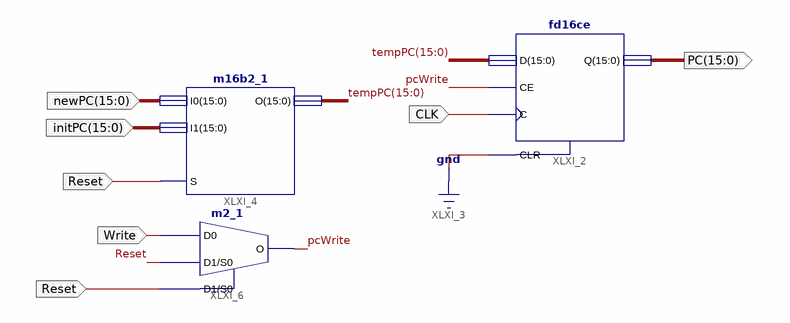
[diagram p0: schematic sheet 1]
// Xilinx ISE schematic pcReg16.sch (spartan3e) as structural Verilog: 3 symbols, 6 ports
module pcReg16 (
  input  CLK,
  input  Reset,
  input  [15:0] initPC,
  input  [15:0] newPC,
  input  Write,
  output [15:0] PC
);

  wire pcWrite;
  wire [15:0] tempPC;

  fd16ce XLXI_2 (.C(CLK), .CE(pcWrite), .CLR(1'b0), .D(tempPC), .Q(PC));
  m16b2_1 XLXI_4 (.I0(newPC), .I1(initPC), .O(tempPC), .S(Reset));
  m2_1 XLXI_6 (.D0(Write), .D1(Reset), .S0(Reset), .O(pcWrite));
endmodule
